# EAGLE design freq_ik3oil (EAGLE 7.2.0)
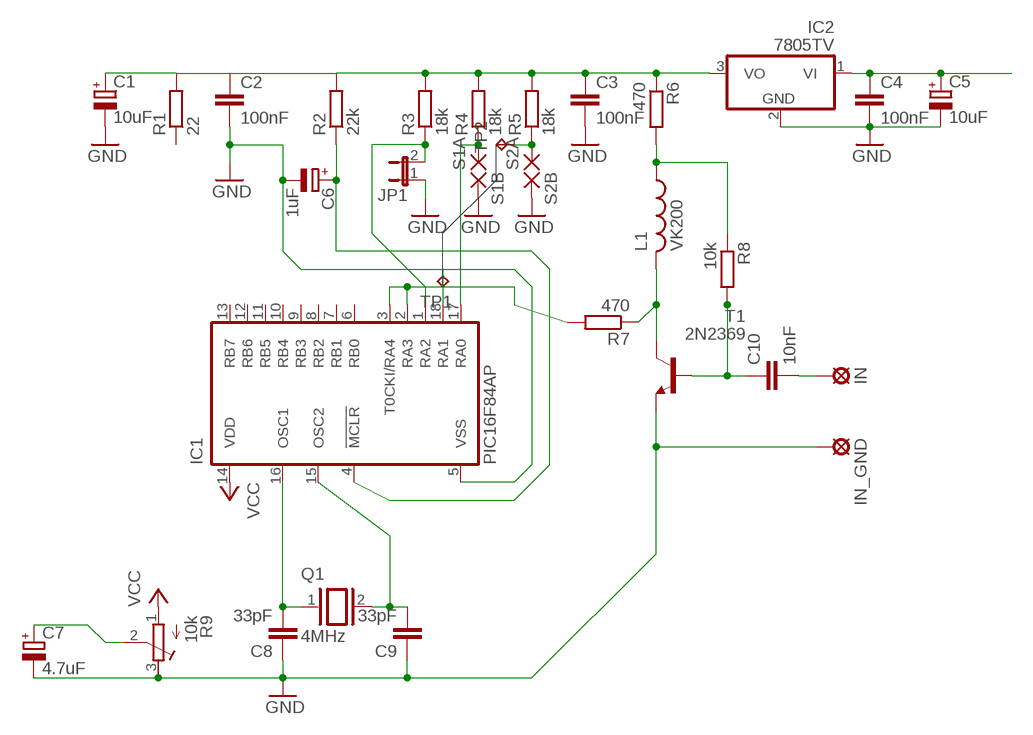
[diagram p0: schematic, sheet 1]

## Parts
C1  10uF  CPOL-EUE2.5-7  [E2,5-7]
C2  100nF  C-EU050-024X044  [C050-024X044]
C3  100nF  C-EU050-024X044  [C050-024X044]
C4  100nF  C-EU050-024X044  [C050-024X044]
C5  10uF  CPOL-EUE2.5-7  [E2,5-7]
C6  1uF  CPOL-EUE2.5-7  [E2,5-7]
C7  4.7uF  CPOL-EUE2.5-7  [E2,5-7]
C8  33pF  C-EU050-024X044  [C050-024X044]
C9  33pF  C-EU050-024X044  [C050-024X044]
C10  10nF  C-EU050-024X044  [C050-024X044]
IC1  PIC16F84AP  [DIL18]
IC2  7805TV  [TO220V]
IN  LSP10  [LSP10]
IN_GND  LSP10  [LSP10]
JP1  JP1E  [JP1]
L1  VK200  L-USTFI0307  [TFI0307]
Q1  4MHz  XTAL/S  [QS]
R1  22  R-EU_0204/7  [0204/7]
R2  22k  R-EU_0204/7  [0204/7]
R3  18k  R-EU_0204/7  [0204/7]
R4  18k  R-EU_0204/7  [0204/7]
R5  18k  R-EU_0204/7  [0204/7]
R6  470  R-EU_0204/7  [0204/7]
R7  470  R-EU_0204/7  [0204/7]
R8  10k  R-EU_0204/7  [0204/7]
R9  10k  R-TRIMM3339P  [RTRIM3339P]
S1A  1,6/0,8  [1,6/0,8]
S1B  1,6/0,8  [1,6/0,8]
S2A  1,6/0,8  [1,6/0,8]
S2B  1,6/0,8  [1,6/0,8]
T1  2N2369  [TO18]
TP1  TPB1,27  [B1,27]
TP2  TPB1,27  [B1,27]

## Nets
GND: C1.- C2.2 C3.2 C4.2 C5.- C6.- C7.- C8.1 C9.1 IC1.5(VSS) IC2.2(GND) IN_GND.MP JP1.1 R9.3(E) S1B.1(P) S2B.1(P) T1.1(E)
N$1: C1.+ C2.1 C3.1 IC2.3(VO) R1.2 R2.2 R3.2 R4.2 R5.2 R6.1
N$2: C4.1 C5.+ IC2.1(VI)
N$3: IC1.1(RA2) JP1.2 R3.1
N$4: IC1.18(RA1) TP1.TP
N$5: C6.+ IC1.4(!MCLR) R2.1
N$7: C8.2 IC1.16(OSC1) Q1.1
N$8: C9.2 IC1.15(OSC2) Q1.2
N$9: IC1.17(RA0) R4.1 S1A.1(P)
N$10: C10.1 R8.2 T1.2(B)
N$11: C10.2 IN.MP
N$12: L1.2 R7.1 T1.3(C)
N$13: C7.+ R9.2(S)
N$14: L1.1 R6.2 R8.1
N$15: R5.1 S2A.1(P) TP2.TP
N$17: IC1.2(RA3) IC1.3(T0CKI/RA4) R7.2
VCC: IC1.14(VDD) R9.1(A)
Unconnected: IC1.6(RB0) IC1.7(RB1) IC1.8(RB2) IC1.9(RB3) IC1.10(RB4) IC1.11(RB5) IC1.12(RB6) IC1.13(RB7) R1.1

## Library data of the parts
C1 C5-C7 = resistor:CPOL-EU: POLARIZED CAPACITOR, European symbol
C2-C4 C8-C10 = rcl:C-EU: CAPACITOR, European symbol
IC1 = microchip:PIC16F8*: MICROCONTROLLER 8-Bit PIC16F8X Family - CMOS Flash/EEPROM Pin Compatible : PIC16F83, PIC16CR83, PIC16F84A, PIC16CR84 see also PIC16C*
IC2 = linear:78*: Positive VOLTAGE REGULATOR Source: http://cache.national.com/ds/LM/LM78L05.pdf http://www.fairchildsemi.com/ds/LM/LM7805.pdf
IN IN_GND = solpad:LSP10: SOLDER PAD drill 1.0 mm, distributor Buerklin, 12H555
JP1 = jumper:JP1E: JUMPER
L1 = rcl:L-US: INDUCTOR, American symbol
Q1 = special:XTAL/S: CRYSTAL
R1-R8 = resistor:R-EU_: RESISTOR, European symbol
R9 = resistor:R-TRIMM: Trimm resistor
S1A S1B S2A S2B = wirepad:1,6/0,8: THROUGH-HOLE PAD
T1 = transistor:2N2369: NPN TRANSISTOR
TP1 TP2 = testpad:TP: Test pad

## Board
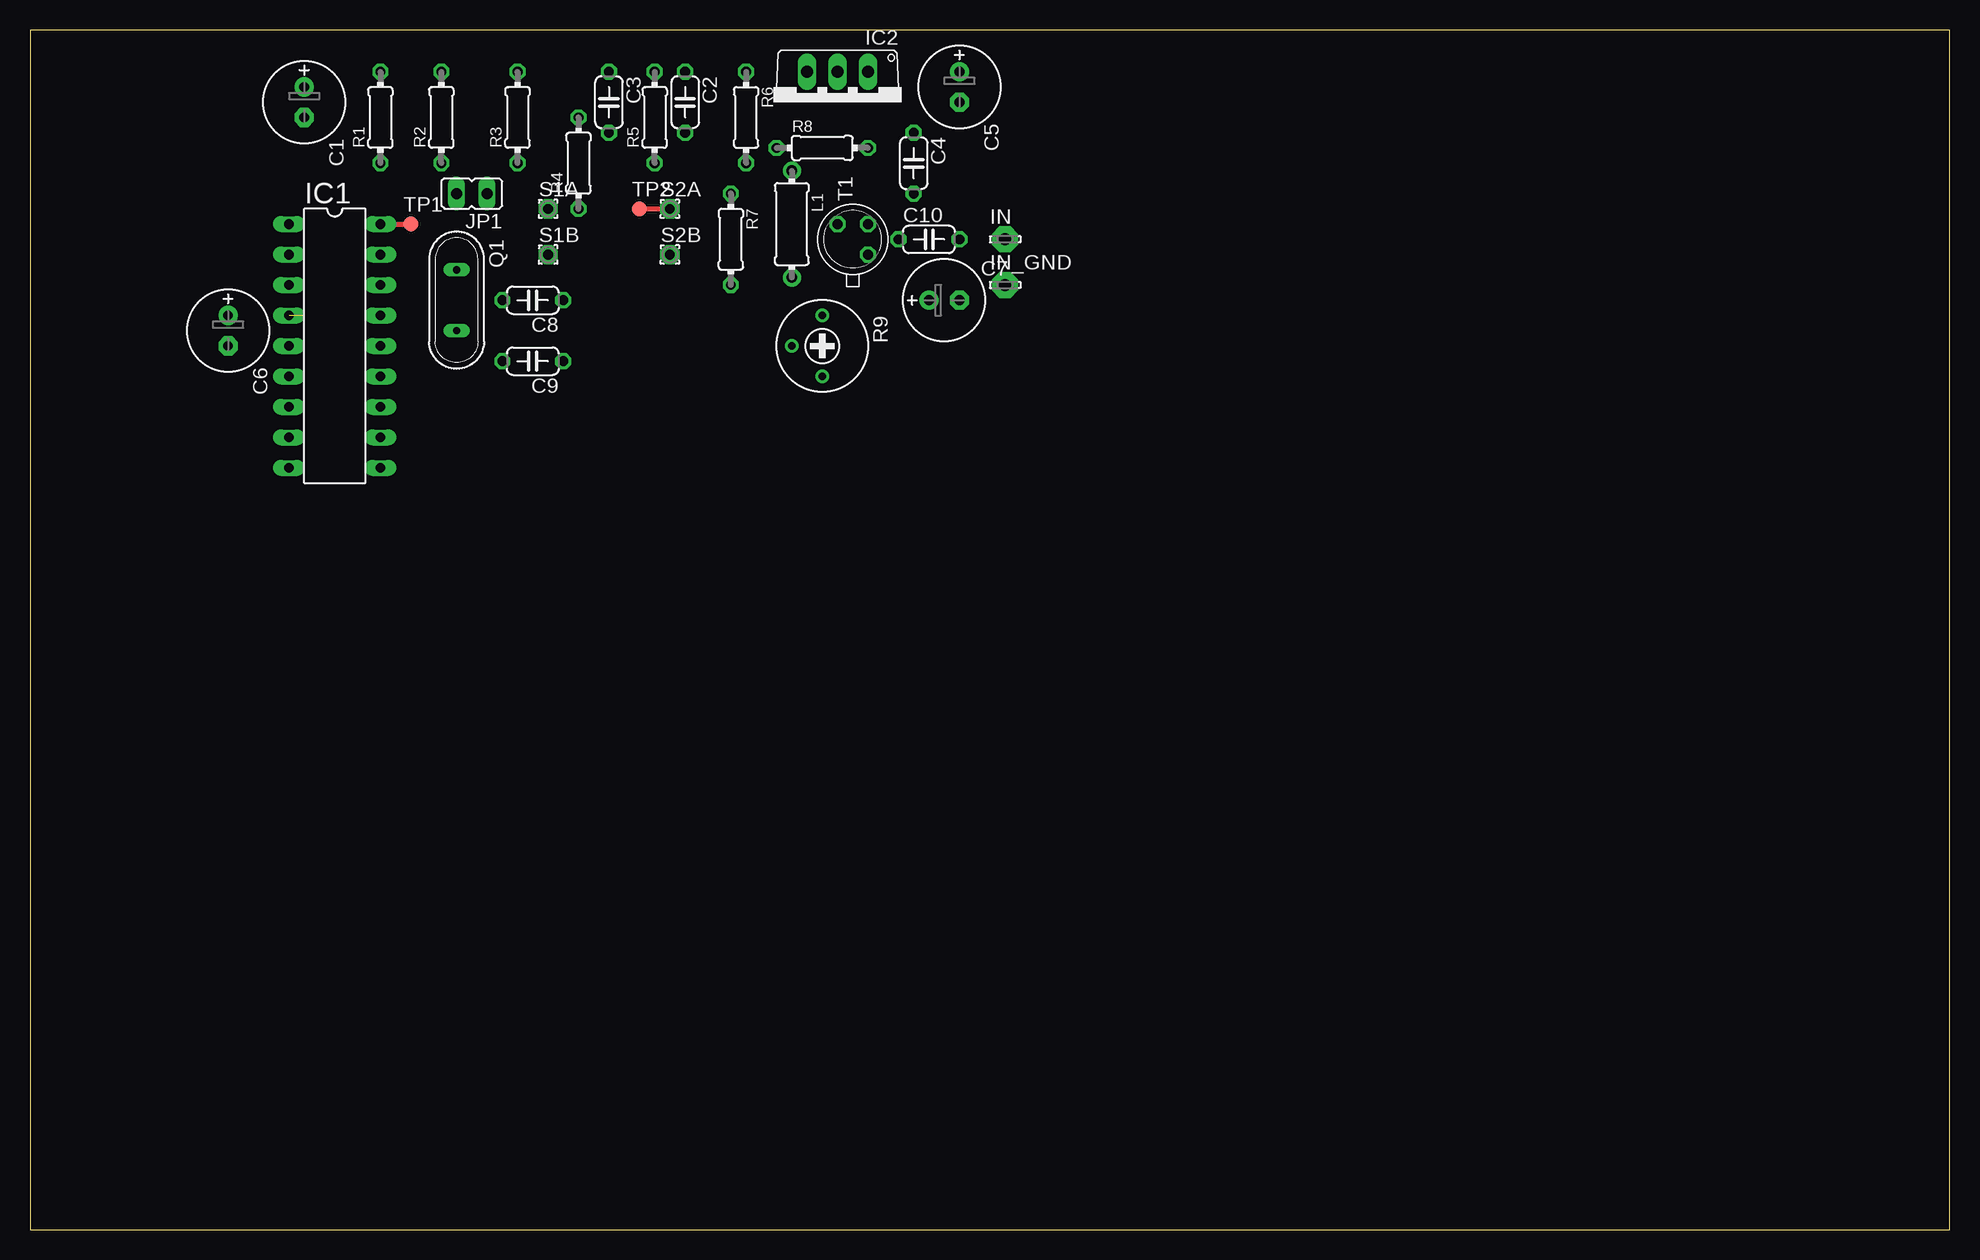
[diagram p1: board, top side]
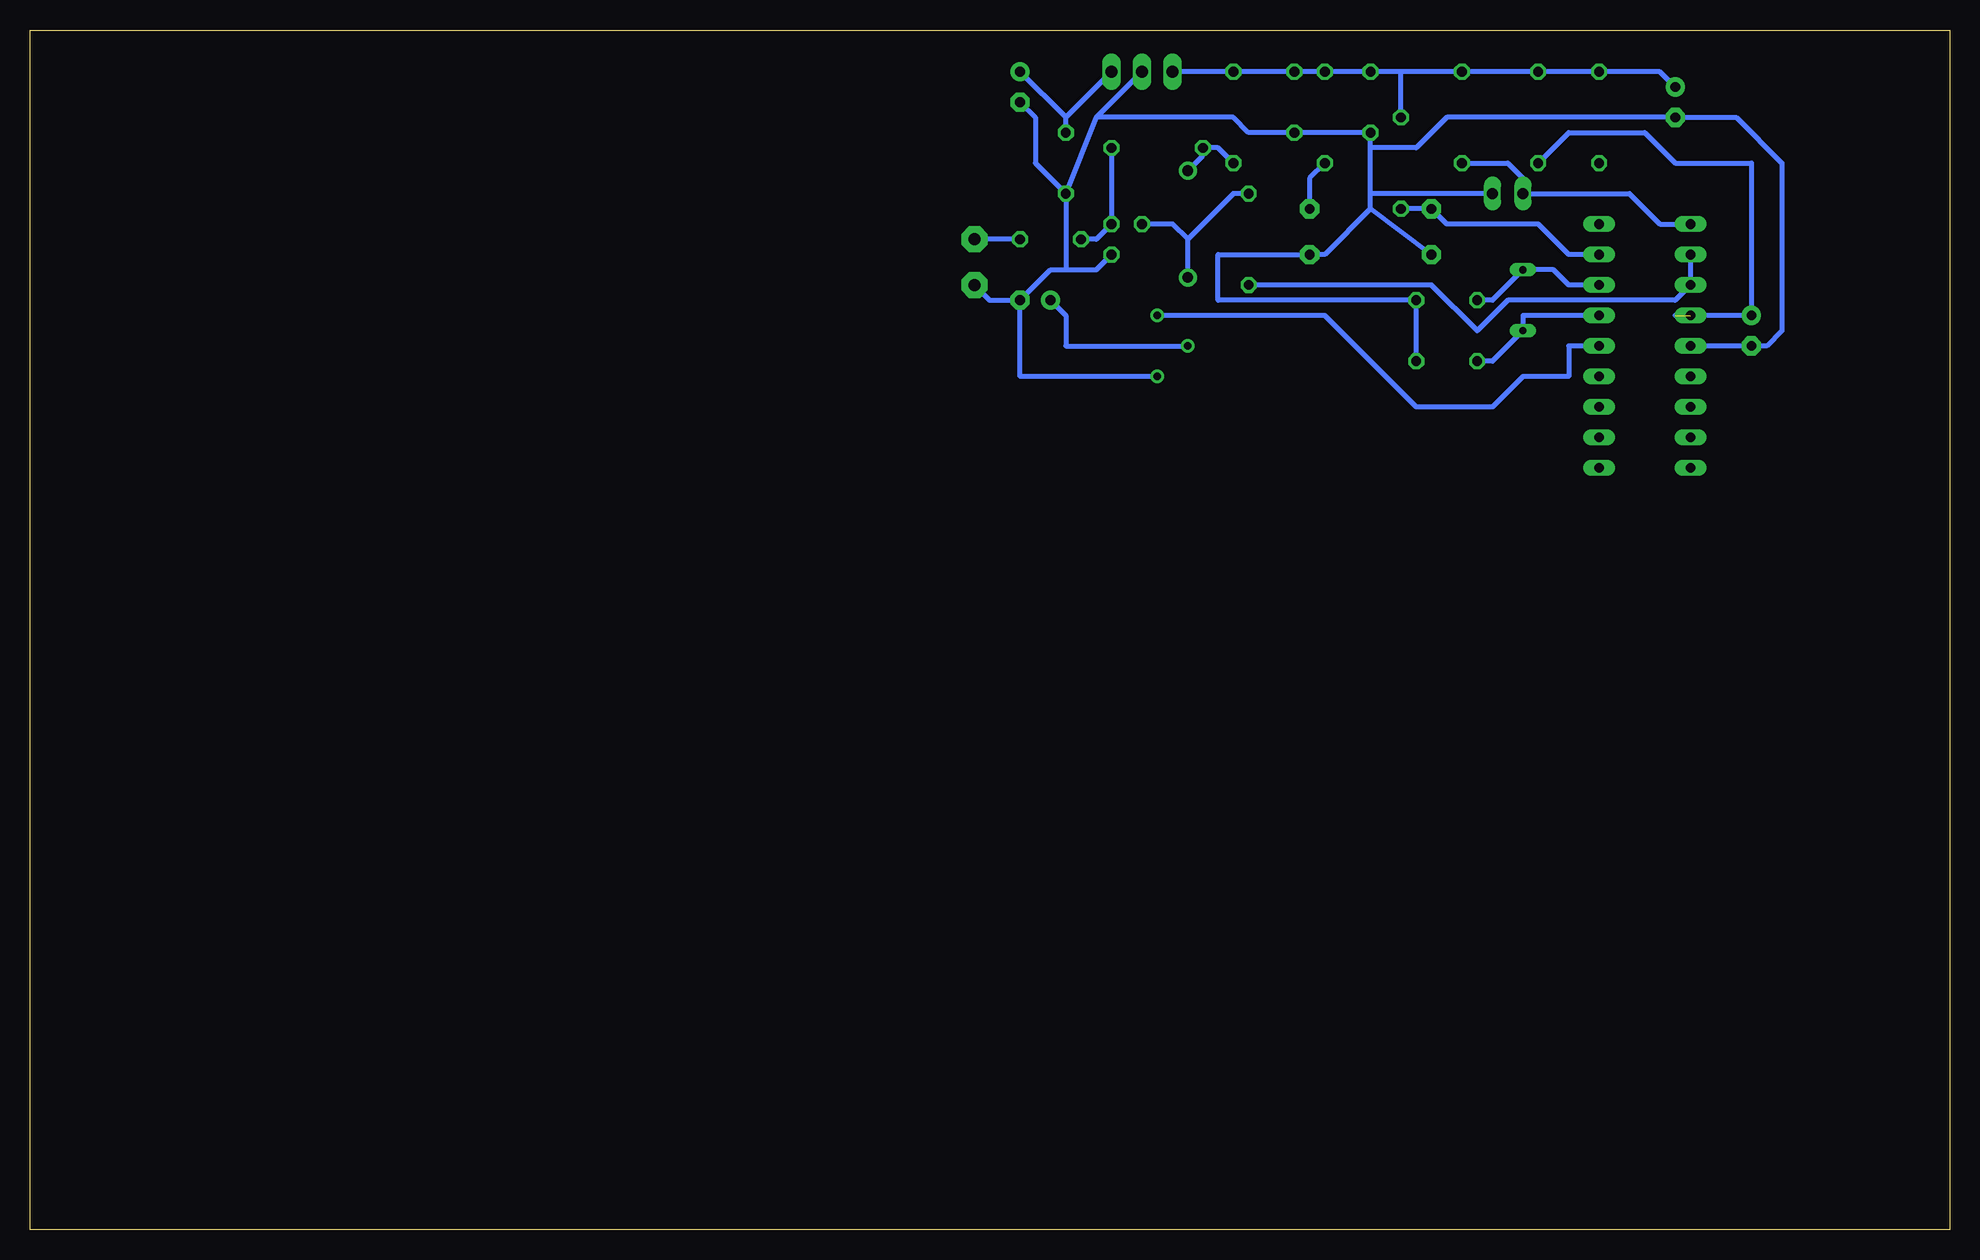
[diagram p2: board, bottom side, seen from below]

Size 160 x 100 mm. Coordinates in mm from the lower left corner, seen from the top.
Outline: 0,0 160,0 160,100 0,100 0,0
Copper layers (1*16): Top 0.035mm / dielectric 1.5mm / Bottom 0.035mm
Design rules "default": minimum track width 10mil, minimum drill 24mil, track to track 8mil, track to pad 8mil, pad to pad 8mil, via to via 8mil, smd to smd 8mil, copper to edge 40mil, drill to drill 8mil, minimum pad ring 10mil, minimum via ring 8mil, stop-mask expansion 4mil, vias tented up to drill 0mil, thermal gap 10mil

### Footprints (pad centres in the part's own frame; a part is rotated, then mirrored left to right if it is on the bottom)
E2,5-7 = drill 0.813 pad 1.6: + -1.27,0 | drill 0.813 pad 1.6 octagon: - 1.27,0
C050-024X044 = drill 0.813 octagon: 1 -2.54,0; 2 2.54,0
DIL18 = drill 0.813 long: 1 -10.16,-3.81; 2 -7.62,-3.81; 3 -5.08,-3.81; 4 -2.54,-3.81; 5 0,-3.81; 6 2.54,-3.81; 7 5.08,-3.81; 8 7.62,-3.81; 9 10.16,-3.81; 10 10.16,3.81; 11 7.62,3.81; 12 5.08,3.81; 13 2.54,3.81; 14 0,3.81; 15 -2.54,3.81; 16 -5.08,3.81; 17 -7.62,3.81; 18 -10.16,3.81
TO220V = drill 1.016 long: 1 -2.54,-2.54; 2 0,-2.54; 3 2.54,-2.54
LSP10 = drill 1.016 pad 2.159 octagon: MP 0,0
JP1 = drill 0.914 long: 1 0,-1.27; 2 0,1.27
TFI0307 = drill 0.9 pad 1.5: 1 -4.445,0; 2 4.445,0
QS = drill 0.61 long: 1 -2.54,0; 2 2.54,0
0204/7 = drill 0.813 octagon: 1 -3.81,0; 2 3.81,0
RTRIM3339P = drill 0.61: 1 -2.54,0; 2 0,-2.54; 3 2.54,0
1,6/0,8 = drill 0.813 pad 1.6 octagon: 1 0,0
TO18 = drill 0.813 octagon: 1 -1.27,-1.27; 2 1.27,-1.27; 3 1.27,1.27
B1,27 = smd 1.27 x 1.27: TP 0,0

### Placement (x,y rotation side)
C1  22.86,93.98 270 top
C2  54.61,93.98 270 top
C3  48.26,93.98 270 top
C4  73.66,88.9 270 top
C5  77.47,95.25 270 top
C6  16.51,74.93 270 top
C7  76.2,77.47 0 top
C8  41.91,77.47 180 top
C9  41.91,72.39 180 top
C10  74.93,82.55 0 top
IC1  25.4,73.66 270 top
IC2  67.31,93.98 180 top
IN  81.28,82.55 0 top
IN_GND  81.28,78.74 0 top
JP1  36.83,86.36 90 top
L1  63.5,83.82 270 top
Q1  35.56,77.47 270 top
R1  29.21,92.71 90 top
R2  34.29,92.71 90 top
R3  40.64,92.71 90 top
R4  45.72,88.9 90 top
R5  52.07,92.71 90 top
R6  59.69,92.71 270 top
R7  58.42,82.55 270 top
R8  66.04,90.17 0 top
R9  66.04,73.66 270 top
S1A  43.18,85.09 0 top
S1B  43.18,81.28 0 top
S2A  53.34,85.09 0 top
S2B  53.34,81.28 0 top
T1  68.58,82.55 90 top
TP1  31.75,83.82 0 top
TP2  50.8,85.09 0 top

### Tracks (layer width: path | path; a pad name or v marks a point on that pad's centre or on a via)
GND
  Bottom 0.406: 71.12,92.71 59.69,92.71 58.42,91.44 C2.2 C3.2 48.26,90.17 | 71.12,92.71 IC2.2 | C5.- 76.2,92.71 76.2,88.9 C4.2 | C4.2 71.12,92.71 | C9.1 C8.1 60.96,77.47 60.96,81.28 S2B.1 52.07,81.28 48.26,85.09 | IC1.5 C6.- 15.24,73.66 13.97,74.93 13.97,88.9 17.78,92.71 C1.- 41.91,92.71 44.45,90.17 48.26,90.17 | JP1.1 48.26,86.36 | 48.26,86.36 48.26,90.17 | S1B.1 48.26,85.09 | 48.26,85.09 48.26,86.36 | R9.3 77.47,71.12 C7.- | IN_GND.MP 80.01,77.47 C7.- | C7.- 74.93,80.01 73.66,80.01 | 73.66,80.01 71.12,80.01 T1.1 | C4.2 73.66,80.01
N$1
  Bottom 0.406: C1.+ 24.13,96.52 R1.2 R2.2 R3.2 45.72,96.52 | IC2.3 R6.1 C2.1 R5.2 C3.1 45.72,96.52 | R4.2 45.72,96.52
N$2
  Bottom 0.406: IC2.1 73.66,92.71 | C4.1 73.66,92.71 | 73.66,92.71 C5.+
N$3
  Bottom 0.406: R3.1 36.83,88.9 35.56,87.63 JP1.2 26.67,86.36 24.13,83.82 IC1.1
N$4
  Top 0.406: IC1.18 TP1.TP
N$5  (1 unrouted)
  Bottom 0.406: 22.86,76.2 C6.+ 16.51,88.9 22.86,88.9 25.4,91.44 31.75,91.44 R2.1
N$7
  Bottom 0.406: IC1.16 31.75,78.74 33.02,80.01 Q1.1 38.1,77.47 C8.2
N$8
  Bottom 0.406: IC1.15 35.56,76.2 Q1.2 38.1,72.39 C9.2
N$9
  Bottom 0.406: IC1.17 31.75,81.28 34.29,83.82 41.91,83.82 S1A.1 R4.1
N$10
  Bottom 0.406: C10.1 71.12,82.55 T1.2 R8.2
N$11
  Bottom 0.406: C10.2 IN.MP
N$12
  Bottom 0.406: R7.1 59.69,86.36 63.5,82.55 | L1.2 63.5,82.55 | 63.5,82.55 64.77,83.82 T1.3
N$13
  Bottom 0.406: C7.+ 73.66,76.2 73.66,73.66 R9.2
N$14
  Bottom 0.406: R6.2 60.96,90.17 R8.1 62.23,89.53 L1.1
N$15
  Top 0.406: TP2.TP S2A.1
  Bottom 0.406: R5.1 53.34,87.63 S2A.1
N$17
  Bottom 0.406: IC1.2 IC1.3 22.86,77.47 36.83,77.47 39.37,74.93 43.18,78.74 R7.2
VCC
  Bottom 0.406: IC1.14 31.75,73.66 31.75,71.12 35.56,71.12 38.1,68.58 44.45,68.58 52.07,76.2 R9.1